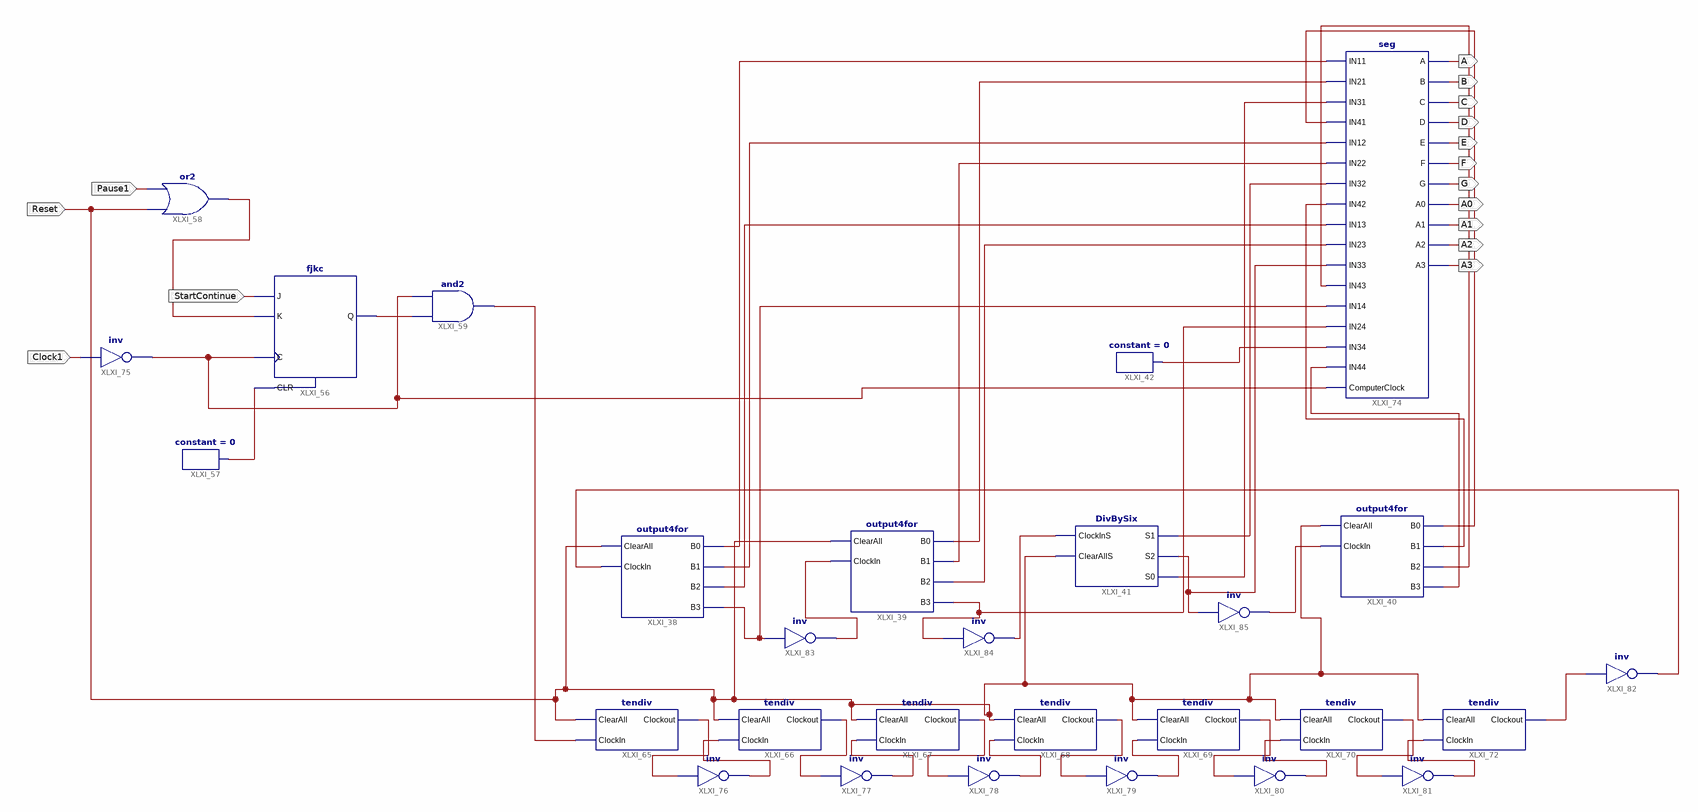
[diagram p0: schematic sheet 1]
// Xilinx ISE schematic assignment5.sch (spartan6) as structural Verilog: 28 symbols, 15 ports
module assignment5 (
  input  StartContinue,
  input  Pause1,
  input  Reset,
  input  Clock1,
  output A,
  output B,
  output C,
  output D,
  output E,
  output F,
  output G,
  output A0,
  output A1,
  output A2,
  output A3
);

  wire Clock, Pause, XLXN_54, XLXN_55, XLXN_56, XLXN_58, XLXN_59, XLXN_60, XLXN_62, XLXN_63, XLXN_65,
       XLXN_66, XLXN_67, XLXN_68, XLXN_69, XLXN_104, XLXN_108, XLXN_110, XLXN_112, XLXN_113, XLXN_114,
       XLXN_115, XLXN_116, XLXN_118, XLXN_120, XLXN_121, XLXN_122, XLXN_123, XLXN_124, XLXN_125, XLXN_126,
       XLXN_127, XLXN_130, XLXN_131, XLXN_132, XLXN_133, XLXN_134, XLXN_135;

  output4for XLXI_38 (.B0(XLXN_54), .B1(XLXN_55), .B2(XLXN_56), .B3(XLXN_131), .ClearAll(Reset), .ClockIn(XLXN_127));
  output4for XLXI_39 (.B0(XLXN_58), .B1(XLXN_59), .B2(XLXN_60), .B3(XLXN_132), .ClearAll(Reset), .ClockIn(XLXN_130));
  output4for XLXI_40 (.B0(XLXN_65), .B1(XLXN_66), .B2(XLXN_67), .B3(XLXN_68), .ClearAll(Reset), .ClockIn(XLXN_135));
  DivBySix XLXI_41 (.ClearAllS(Reset), .ClockInS(XLXN_133), .S0(XLXN_63), .S1(XLXN_62), .S2(XLXN_134));
  constant #(.CValue("0")) XLXI_42 (.O(XLXN_69));
  fjkc XLXI_56 (.C(Clock), .CLR(XLXN_104), .J(StartContinue), .K(Pause), .Q(XLXN_108));
  constant #(.CValue("0")) XLXI_57 (.O(XLXN_104));
  or XLXI_58 (Pause, Reset, Pause1);
  and XLXI_59 (XLXN_110, XLXN_108, Clock);
  tendiv XLXI_65 (.ClearAll(Reset), .ClockIn(XLXN_110), .Clockout(XLXN_112));
  tendiv XLXI_66 (.ClearAll(Reset), .ClockIn(XLXN_113), .Clockout(XLXN_114));
  tendiv XLXI_67 (.ClearAll(Reset), .ClockIn(XLXN_115), .Clockout(XLXN_116));
  tendiv XLXI_68 (.ClearAll(Reset), .ClockIn(XLXN_118), .Clockout(XLXN_120));
  tendiv XLXI_69 (.ClearAll(Reset), .ClockIn(XLXN_121), .Clockout(XLXN_122));
  tendiv XLXI_70 (.ClearAll(Reset), .ClockIn(XLXN_123), .Clockout(XLXN_124));
  tendiv XLXI_72 (.ClearAll(Reset), .ClockIn(XLXN_125), .Clockout(XLXN_126));
  seg XLXI_74 (
    .A(A), .A0(A0), .A1(A1), .A2(A2), .A3(A3), .B(B), .C(C), .ComputerClock(Clock), .D(D), .E(E), .F(F),
    .G(G), .IN11(XLXN_54), .IN12(XLXN_55), .IN13(XLXN_56), .IN14(XLXN_131), .IN21(XLXN_58), .IN22(XLXN_59),
    .IN23(XLXN_60), .IN24(XLXN_132), .IN31(XLXN_63), .IN32(XLXN_62), .IN33(XLXN_134), .IN34(XLXN_69),
    .IN41(XLXN_65), .IN42(XLXN_66), .IN43(XLXN_67), .IN44(XLXN_68));
  not XLXI_75 (Clock, Clock1);
  not XLXI_76 (XLXN_113, XLXN_112);
  not XLXI_77 (XLXN_115, XLXN_114);
  not XLXI_78 (XLXN_118, XLXN_116);
  not XLXI_79 (XLXN_121, XLXN_120);
  not XLXI_80 (XLXN_123, XLXN_122);
  not XLXI_81 (XLXN_125, XLXN_124);
  not XLXI_82 (XLXN_127, XLXN_126);
  not XLXI_83 (XLXN_130, XLXN_131);
  not XLXI_84 (XLXN_133, XLXN_132);
  not XLXI_85 (XLXN_135, XLXN_134);
endmodule
